# EAGLE design SparkFun_Roshamglo (EAGLE 7.7.0)
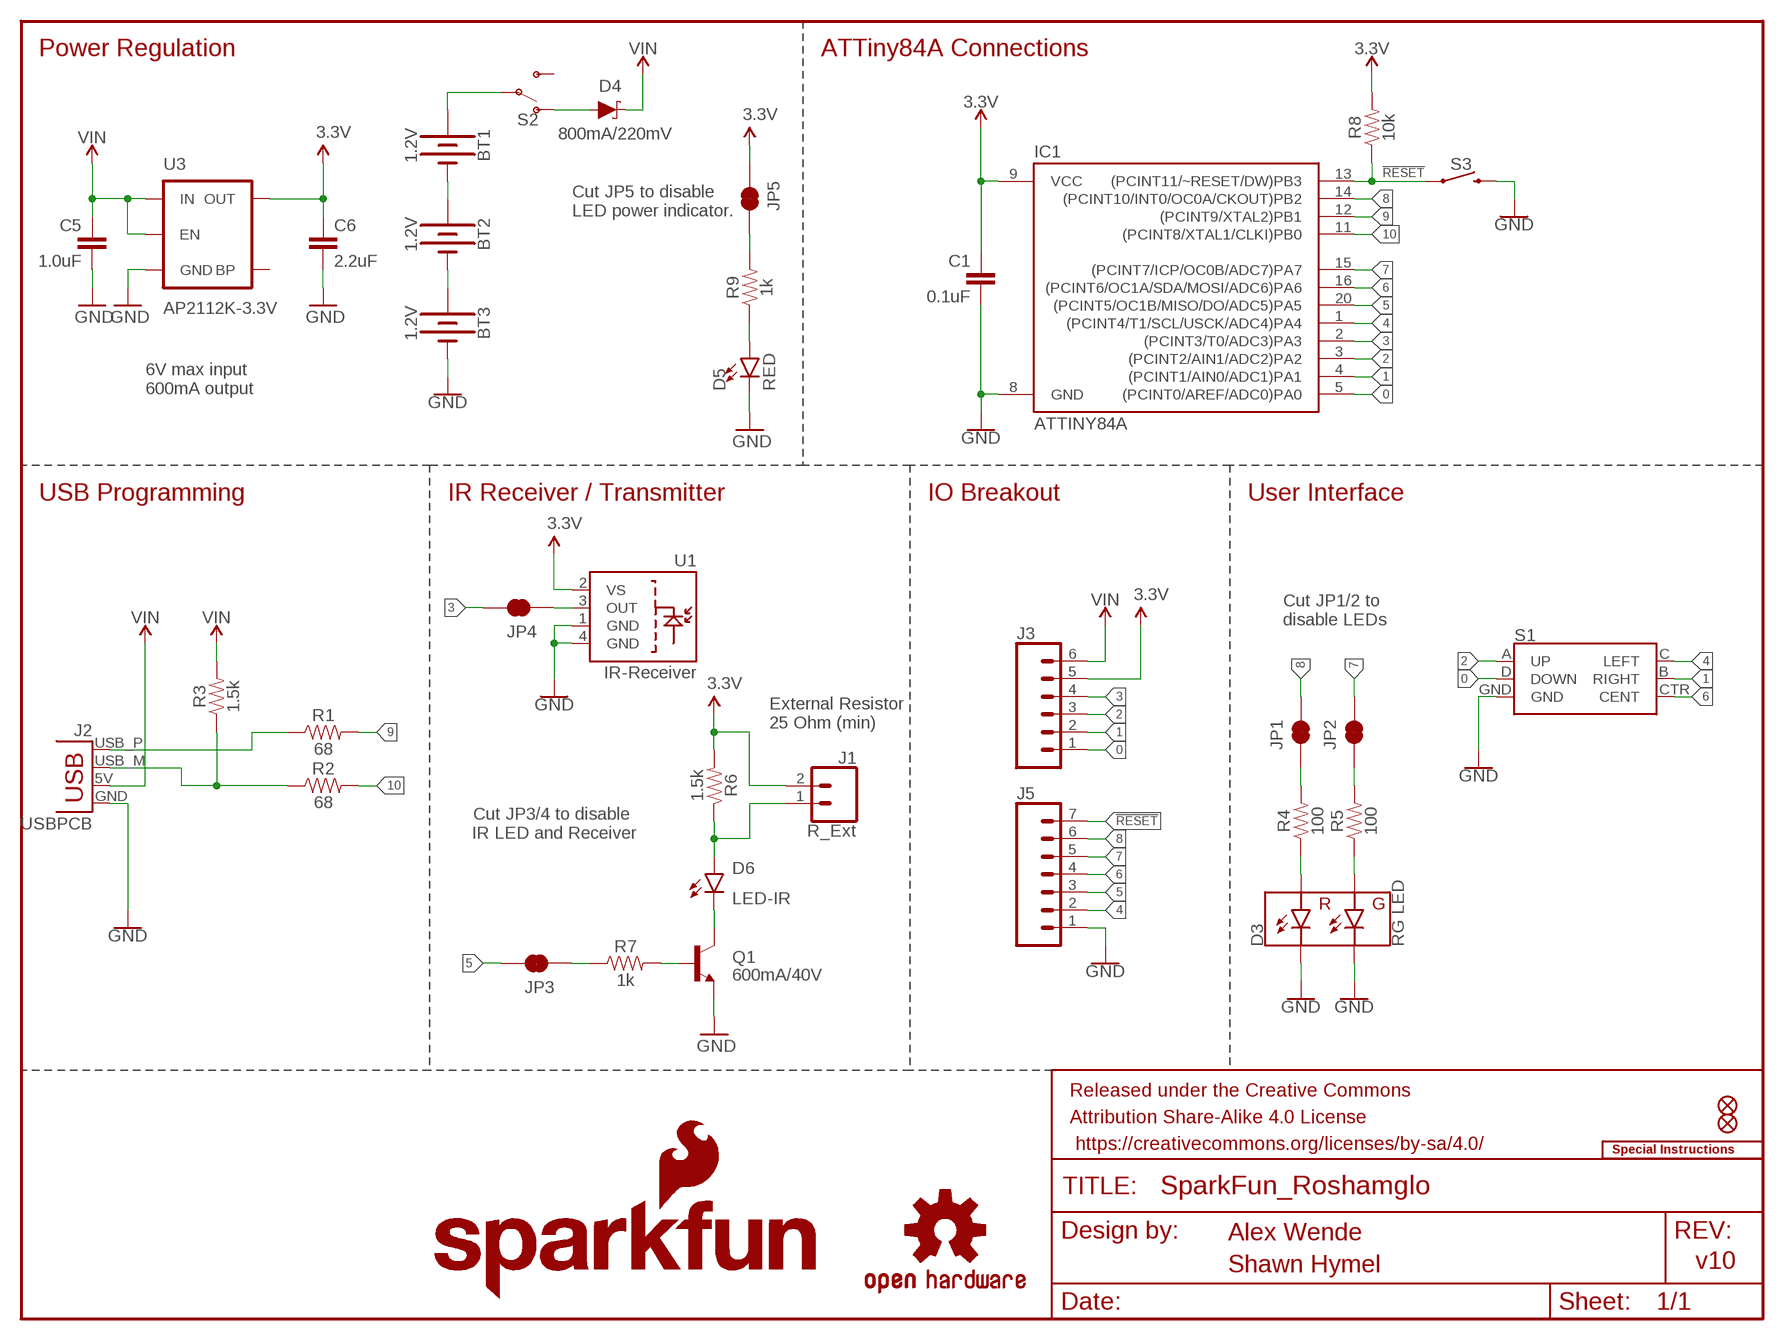
[diagram p0: schematic, sheet 1]

## Parts
BT1  1.2V  BATTERY-AAA_KIT  [BATTERY-AAA-KIT]
BT2  1.2V  BATTERY-AAA_KIT  [BATTERY-AAA-KIT]
BT3  1.2V  BATTERY-AAA_KIT  [BATTERY-AAA-KIT]
C1  0.1uF  0.1UF-0603-25V-(+80/-20%)  [0603]
C5  1.0uF  1.0UF-25V-+80/-20(0805)"  [0805-CAP]
C6  2.2uF  2.2UF-10V-20%(0603)  [0603-CAP]
D3  RG LED  LED-RGLTST-C195KGJRKT  [LTST-C195KGJRKT]
D4  800mA/220mV  CUS08F30SOD-323  [SOD-323]
D5  RED  LED-RED0603  [LED-0603]
D6  LED-IR  LED-IR-SMDSFH4045N  [SFH4045N]
FD1  FIDUCIALUFIDUCIAL  [FIDUCIAL-MICRO]
FD2  FIDUCIALUFIDUCIAL  [FIDUCIAL-MICRO]
FRAME1  FRAME-LETTER  [CREATIVE_COMMONS]
IC1  ATTINY84A  ATTINY84ATTINY84-20MU  [QFN20]
J1  R_Ext  CONN_021X02_NO_SILK  [1X02_NO_SILK]
J2  USBPCB  USBPCB_NOPASTE  [USB-A-PCB-NOPASTE]
J3  CONN_06NO_SILK_FEMALE_PTH  [1X06_NO_SILK]
J5  CONN_07NO_SILK  [1X07_NO_SILK]
JP1  JUMPER-SMT_2_NC_TRACE_SILK  [SMT-JUMPER_2_NC_TRACE_SILK]
JP2  JUMPER-SMT_2_NC_TRACE_SILK  [SMT-JUMPER_2_NC_TRACE_SILK]
JP3  JUMPER-SMT_2_NC_TRACE_SILK  [SMT-JUMPER_2_NC_TRACE_SILK]
JP4  JUMPER-SMT_2_NC_TRACE_SILK  [SMT-JUMPER_2_NC_TRACE_SILK]
JP5  JUMPER-SMT_2_NC_TRACE_SILK  [SMT-JUMPER_2_NC_TRACE_SILK]
LOGO1  OSHW-LOGOS  [OSHW-LOGO-S]
LOGO2  SFE_LOGO_NAME_FLAME.2_INCH  [SFE_LOGO_NAME_FLAME_.2]
Q1  600mA/40V  TRANS_NPN-MMBT2222AL  [SOT23-3]
R1  68  68OHM-0603-1/10W-1%  [0603]
R2  68  68OHM-0603-1/10W-1%  [0603]
R3  1.5k  1.5KOHM-0603-1/10W-1%  [0603]
R4  100  100OHM-0603-1/10W-1%  [0603]
R5  100  100OHM-0603-1/10W-1%  [0603]
R6  1.5k  1.5KOHM-0603-1/10W-1%  [0603]
R7  1k  1KOHM-0603-1/10W-1%  [0603]
R8  10k  10KOHM-0603-1/10W-1%  [0603]
R9  1k  1KOHM-0603-1/10W-1%  [0603]
S1  JOYSTICK_MINI  [JOYSTICK_MINI]
S2  SWITCH-SPDT-SMD-RIGHT-ANGLE  [SWITCH_SPST_SMD_A]
S3  MOMENTARY-SWITCH-SPST-SMD-4.6X2.8MM  [TACTILE_SWITCH_SMD_4.6X2.8MM]
U1  IR-Receiver  TSOP75XXXWSIDE_VIEW  [TSOP75XXXWTR]
U3  AP2112K-3.3V  V_REG_LDOSMD  [SOT23-5]
U$5  SPECIAL_INSTRUCTIONS-ORDERING  [ORDERING_INSTRUCTIONS]

## Nets
0: IC1.5((PCINT0/AREF/ADC0)PA0) J3.1 S1.D(DOWN)
1: IC1.4((PCINT1/AIN0/ADC1)PA1) J3.2 S1.B(RIGHT)
2: IC1.3((PCINT2/AIN1/ADC2)PA2) J3.3 S1.A(UP)
3: IC1.2((PCINT3/T0/ADC3)PA3) J3.4 JP4.2
3.3V: C1.1 C6.1 IC1.9(VCC) J1.2 J3.5 JP5.1 R6.2 R8.2 U1.2(VS) U3.5(OUT)
4: IC1.1((PCINT4/T1/SCL/USCK/ADC4)PA4) J5.2 S1.C(LEFT)
5: IC1.20((PCINT5/OC1B/MISO/DO/ADC5)PA5) J5.3 JP3.2
6: IC1.16((PCINT6/OC1A/SDA/MOSI/ADC6)PA6) J5.4 S1.CTR(CENT)
7: IC1.15((PCINT7/ICP/OC0B/ADC7)PA7) J5.5 JP2.2
8: IC1.14((PCINT10/INT0/OC0A/CKOUT)PB2) J5.6 JP1.2
9: IC1.12((PCINT9/XTAL2)PB1) R1.2
10: IC1.11((PCINT8/XTAL1/CLKI)PB0) R2.2
!RESET: IC1.13((PCINT11/~RESET/DW)PB3) J5.7 R8.1 S3.1 S3.2
D+: J2.USB_P(D+) R1.1
D-: J2.USB_M(D-) R2.1 R3.1
GND: BT3.GND@1(-) C1.2 C5.2 C6.2 D3.P$3(GC) D3.P$4(RC) D5.C IC1.8(GND) J2.GND J5.1 Q1.2(E) S1.GND S3.3 S3.4 U1.1(GND) U1.4(GND) U3.2(GND)
N$1: D5.A R9.1
N$2: D3.P$2(RA) R4.1
N$3: D4.A S2.1(O)
N$4: D3.P$1(GA) R5.1
N$5: D6.1(C) Q1.3(C)
N$6: Q1.1(B) R7.2
N$7: JP1.1 R4.2
N$8: JP2.1 R5.2
N$9: JP4.1 U1.3(OUT)
N$10: JP3.1 R7.1
N$11: JP5.2 R9.2
N$12: BT1.GND@1(-) BT2.PWR@1(+)
N$13: BT2.GND@1(-) BT3.PWR@1(+)
N$14: D6.2(A) J1.1 R6.1
V_BATT: BT1.PWR@1(+) S2.2(P)
VIN: C5.1 D4.C J2.5V(VBUS) J3.6 R3.2 U3.1(IN) U3.3(EN)
Unconnected: S2.3(S) U3.4(BP)

## Notes on the sheet
- Power Regulation | ATTiny84A Connections
- Cut JP5 to disable
  LED power indicator.
- 6V max input
  600mA output
- USB Programming | IR Receiver / Transmitter | IO Breakout | User Interface
- Cut JP1/2 to
  disable LEDs
- External Resistor
  25 Ohm (min)
- Cut JP3/4 to disable 
  IR LED and Receiver
- Alex Wende
- Shawn Hymel | v10

## Library data of the parts
BT1-BT3 = SparkFun-Batteries:BATTERY: Battery - Single Cell A variety of battery chemistries, sizes, and footprints. Device List: 20MM_PTH - Coin Cell Battery Holder - 20mm (PTH) <https://www.sparkfun.com/products/783> 12MM_SMD - Coin Cell Battery Holder - 12mm (SMD) <https://www.sparkfun.com/products/10592> 12MM_PTH - Coin Cell Battery Holder - 12mm (PTH) <https://www.sparkfun.com/products/7948> 20MM_SMD - 20mm Coin Cell Battery Holder (SMD) (2 legs) Used on the Big Time Watch Kit <https://www.sparkfun.com/products/11734> 20MM_SMD_4LEGS - Coin Cell Battery Holder - 20mm (SMD) <https://www.sparkfun.com/products/11892> 20MM_SMD_4LEGS_OVERPASTE - Coin Cell Battery Holder - 20mm (SMD) <https://www.sparkfun.com/products/11892> (Over-paste on the legs) 24.5MM_PTH - Coin Cell Battery Holder - 24.5mm (PTH) <https://www.sparkfun.com/products/8863> 9V - 9V Battery Holder - PC Mount Used on the SparkFun SparkPunk Sound Kit <https://www.sparkfun.com/products/11177> and SparkFun SparkPunk Sequencer Kit <https://www.sparkfun.com/products/12707> 18650 - Battery Holder - 18650 (PTH) <https://www.sparkfun.com/products/13113> AA - Battery Holder - 1xAA (PTH) <https://www.sparkfun.com/products/7949> AAA - Battery Holder - 1xAAA (PTH) <https://www.sparkfun.com/products/12718> AA_KIT - Battery Holder - 1xAA (PTH) <https://www.sparkfun.com/products/7949> Special kit package - pads only have exposed copper on one side of the board. AAA_KIT - Battery Holder - 1xAAA (PTH) <https://www.sparkfun.com/products/12718> Special kit package - pads only have exposed copper on one side of the board.; PROD_ID: BATT-08571; SF_SKU: PRT-12718
C1 = SparkFun-Capacitors:0.1UF: 0.1µF ceramic capacitors A capacitor is a passive two-terminal electrical component used to store electrical energy temporarily in an electric field.; PROD_ID: CAP-00810
C5 = SparkFun-Capacitors:1.0UF-25V-+80/-20(0805): CAP-11625; PROD_ID: CAP-11625
C6 = SparkFun-Capacitors:2.2UF-10V-20%(0603): CAP-07888; PROD_ID: CAP-07888
D3 = SparkFun-LED:LED-RG: LiteOn Technology Corporation LTST-C195KGJRKT - LED GREEN/RED CLEAR 0606 SMD Color: Red/Green Lens Transparency: Clear Lens Style/Size: Rectangle with Flat top, 1.10 x 1.5 mm mC Rating45mcd Red, 35 mcd Green Current: 20mA Red, 20mA Green Forward Voltage: 2V Red, 2V Green Packages: 0606 SparkFun Products: Electric Imp imp002 Breakout <[https://www.sparkfun.com/products/12958]>; PROD_ID: DIO-12140
D4 = Roshamglo:CUS08F30; PROD_ID: DIO-13570
D5 = SparkFun-LED:LED-RED: Red SMD LED Used in manufacturing of most products at SparkFun Packages: 0603 - SMD 0603 package [Product Link] <http://docs.avagotech.com/docs/AV02-0551EN> 0603 SMART - SMD 0603 SMART package ( more efficient and expensive)[Product Link] <http://www.osram-os.com/Graphics/XPic2/00077099_0.pdf> 1206 - SMD1206 package [Product Link] <https://www.sparkfun.com/datasheets/DevTools/LilyPad/Q150OVS4.pdff> SparkFun Products: Pro Mini 328 -5V <https://www.sparkfun.com/products/821> RedBoard <https://www.sparkfun.com/products/12757> IOIO-OTG <https://www.sparkfun.com/products/13613>; PROD_ID: DIO-00819
D6 = Roshamglo:LED-IR-SMD: IR LED - Surface mount Surface mount (SMD) infrared (IR) LEDs SparkFun Products: N/A <https://www.sparkfun.com/>; PROD_ID: DIO-13574
FD1 FD2 = SparkFun-Aesthetics:FIDUCIAL: Fiducial Alignment Points Point-of-reference for pick-and-place machines and other optical instruments.
FRAME1 = SparkFun-Aesthetics:FRAME-LETTER: Schematic Frame - Letter Standard 8.5x11 US Letter frame
IC1 = SparkFun-IC-Microcontroller:ATTINY84: Atmel 14-pin 2/4/8kB flash uC Datasheet <https://cdn.sparkfun.com/datasheets/Widgets/doc8006.pdf> SparkFun Products Tiny AVR Programmer <https://www.sparkfun.com/products/11801> (PGM-11801) SparkFun Servo Trigger - Continuous Rotation <https://www.sparkfun.com/products/13872> (WIG-13872) SparkFun Servo Trigger <https://www.sparkfun.com/products/13118> (WIG-13118); PROD_ID: IC-13571
J1 = SparkFun-Connectors:CONN_02: Multi connection point. Often used as Generic Header-pin footprint for 0.1 inch spaced/style header connections On any of the 0.1 inch spaced packages, you can populate with these: Break Away Headers - Straight <https://www.sparkfun.com/products/116> (PRT-00116) Break Away Male Headers - Right Angle <https://www.sparkfun.com/products/553> (PRT-00553) Female Headers <https://www.sparkfun.com/products/115> (PRT-00115) Break Away Headers - Machine Pin <https://www.sparkfun.com/products/117> (PRT-00117) Break Away Female Headers - Swiss Machine Pin <https://www.sparkfun.com/products/743> (PRT-00743) For SCREWTERMINALS and SPRING TERMINALS visit here: Screw Terimnals on SparkFun.com <https://www.sparkfun.com/search/results?term=Screw+Terminals> (5mm/3.5mm/2.54mm spacing) This device is also useful as a general connection point to wire up your design to another part of your project. Our various solder wires solder well into these plated through hole pads. Hook-Up Wire - Assortment (Stranded, 22 AWG) <https://www.sparkfun.com/products/11375> (PRT-11375) Hook-Up Wire - Assortment (Solid Core, 22 AWG) <https://www.sparkfun.com/products/11367> (PRT-11367) View the entire wire category on our website here <https://www.sparkfun.com/categories/141> Special notes: Molex polarized connector foot print use with: PRT-08233 with associated crimp pins and housings. 2.54_SCREWTERM for use with PRT-10571. 3.5mm Screw Terminal footprints for PRT-08084 5mm Screw Terminal footprints for use with PRT-08432
J2 = SparkFun-Connectors:USB: USB Connectors USB-B-PTH is fully proven SKU : PRT-00139/CONN-08278 USB-miniB is fully proven SKU : PRT-00587 USB-A-PCB is untested. USB-A-H is throughly reviewed, but untested. Spark Fun Electronics SKU : PRT-00437 USB-B-SMT is throughly reviewed, but untested. Needs silkscreen touching up. USB-A-S has not been used/tested USB-MB-H has not been used/tested USB-MICROB has been used. CONN-09505
J3 = SparkFun-Connectors:CONN_06: Multi connection point. Often used as Generic Header-pin footprint for 0.1 inch spaced/style header connections On any of the 0.1 inch spaced packages, you can populate with these: Break Away Headers - Straight <https://www.sparkfun.com/products/116> (PRT-00116) Break Away Male Headers - Right Angle <https://www.sparkfun.com/products/553> (PRT-00553) Female Headers <https://www.sparkfun.com/products/115> (PRT-00115) Break Away Headers - Machine Pin <https://www.sparkfun.com/products/117> (PRT-00117) Break Away Female Headers - Swiss Machine Pin <https://www.sparkfun.com/products/743> (PRT-00743) Arduino Stackable Header - 6 Pin <https://www.sparkfun.com/products/9280> (PRT-09280) For SCREWTERMINALS and SPRING TERMINALS visit here: Screw Terimnals on SparkFun.com <https://www.sparkfun.com/search/results?term=Screw+Terminals> (5mm/3.5mm/2.54mm spacing) This device is also useful as a general connection point to wire up your design to another part of your project. Our various solder wires solder well into these plated through hole pads. Hook-Up Wire - Assortment (Stranded, 22 AWG) <https://www.sparkfun.com/products/11375> (PRT-11375) Hook-Up Wire - Assortment (Solid Core, 22 AWG) <https://www.sparkfun.com/products/11367> (PRT-11367) View the entire wire category on our website here <https://www.sparkfun.com/categories/141> Special notes: Molex polarized connector foot print use with SKU : PRT-08231 with associated crimp pins and housings. 1MM SMD Version SKU: PRT-10208 NOTES ON THE VARIANTS LOCK and LOCK_LONGPADS... This footprint was designed to help hold the alignment of a through-hole component (i.e. 6-pin header) while soldering it into place. You may notice that each hole has been shifted either up or down by 0.005 of an inch from it's more standard position (which is a perfectly straight line). This slight alteration caused the pins (the squares in the middle) to touch the edges of the holes. Because they are alternating, it causes a "brace" to hold the component in place. 0.005 has proven to be the perfect amount of "off-center" position when using our standard breakaway headers. Although looks a little odd when you look at the bare footprint, once you have a header in there, the alteration is very hard to notice. Also,if you push a header all the way into place, it is covered up entirely on the bottom side.; PROD_ID: CONN-08437
J5 = SparkFun-Connectors:CONN_07: Multi connection point. Often used as Generic Header-pin footprint for 0.1 inch spaced/style header connections On any of the 0.1 inch spaced packages, you can populate with these: Break Away Headers - Straight <https://www.sparkfun.com/products/116> (PRT-00116) Break Away Male Headers - Right Angle <https://www.sparkfun.com/products/553> (PRT-00553) Female Headers <https://www.sparkfun.com/products/115> (PRT-00115) Break Away Headers - Machine Pin <https://www.sparkfun.com/products/117> (PRT-00117) Break Away Female Headers - Swiss Machine Pin <https://www.sparkfun.com/products/743> (PRT-00743) For SCREWTERMINALS and SPRING TERMINALS visit here: Screw Terimnals on SparkFun.com <https://www.sparkfun.com/search/results?term=Screw+Terminals> (5mm/3.5mm/2.54mm spacing) This device is also useful as a general connection point to wire up your design to another part of your project. Our various solder wires solder well into these plated through hole pads. Hook-Up Wire - Assortment (Stranded, 22 AWG) <https://www.sparkfun.com/products/11375> (PRT-11375) Hook-Up Wire - Assortment (Solid Core, 22 AWG) <https://www.sparkfun.com/products/11367> (PRT-11367) View the entire wire category on our website here <https://www.sparkfun.com/categories/141> Special notes: Molex polarized connector foot print use with SKU : PRT-08231 with associated crimp pins and housings. 1MM SMD Version SKU: PRT-10208 NOTES ON THE VARIANTS LOCK and LOCK_LONGPADS... This footprint was designed to help hold the alignment of a through-hole component (i.e. 6-pin header) while soldering it into place. You may notice that each hole has been shifted either up or down by 0.005 of an inch from it's more standard position (which is a perfectly straight line). This slight alteration caused the pins (the squares in the middle) to touch the edges of the holes. Because they are alternating, it causes a "brace" to hold the component in place. 0.005 has proven to be the perfect amount of "off-center" position when using our standard breakaway headers. Although looks a little odd when you look at the bare footprint, once you have a header in there, the alteration is very hard to notice. Also,if you push a header all the way into place, it is covered up entirely on the bottom side.
JP1-JP5 = SparkFun-Jumpers:JUMPER-SMT_2_NC_TRACE: Normally closed trace jumper This jumper has a trace between two pads so it's normally closed (NC). Use a razor knife to open the connection. For best results follow the IPC guidelines for cutting traces: Cutout at least 0.063 mm (0.005 in). Remove all loose material to clean up the cut area. Seal the cut with an approved epoxy. Reapply solder to reclose the connection.
LOGO1 = SparkFun-Aesthetics:OSHW-LOGO: Open-Source Hardware (OSHW) Logo This logo indicates the piece of hardware it is found on incorporates a OSHW license and/or adheres to the definition of open source hardware found here: http://freedomdefined.org/OSHW
LOGO2 = SparkFun-Aesthetics:SFE_LOGO_NAME_FLAME: SparkFun Font Logo w/ Flame This is the SparkFun full logo. The logo on the schematic will always be the same size; the package variant is the height of the flame part of the logo. Default layer for the logo on the board is tSilk.
Q1 = SparkFun-DiscreteSemi:TRANS_NPN: NPN transistor Current controlled devices typically used to amplify current or used as a switch. BC547 - COM-08928 <http://www.sparkfun.com/products/8928> (TO-92 45V 100mA) (1.Collector 2.Base 3.Emitter) 2N3904 - COM-00521 <http://www.sparkfun.com/products/521> (TO-92 40V 200mA) (1.Emitter 2.Base 3.Collector) P2N2222A - COM-12852 <http://www.sparkfun.com/products/12852> (TO-92 40V 600mA) (1.Collector 2.Base 3.Emitter); PROD_ID: TRANS-08049
R1 R2 = SparkFun-Resistors:68OHM: 68Ω resistor A resistor is a passive two-terminal electrical component that implements electrical resistance as a circuit element. Resistors act to reduce current flow, and, at the same time, act to lower voltage levels within circuits. - Wikipedia; PROD_ID: RES-07860
R3 R6 = SparkFun-Resistors:1.5KOHM: 1.5kΩ resistor A resistor is a passive two-terminal electrical component that implements electrical resistance as a circuit element. Resistors act to reduce current flow, and, at the same time, act to lower voltage levels within circuits. - Wikipedia; PROD_ID: RES-08306
R4 R5 = SparkFun-Resistors:100OHM: 100Ω resistor A resistor is a passive two-terminal electrical component that implements electrical resistance as a circuit element. Resistors act to reduce current flow, and, at the same time, act to lower voltage levels within circuits. - Wikipedia; PROD_ID: RES-07863
R7 R9 = SparkFun-Resistors:1KOHM: 1kΩ resistor A resistor is a passive two-terminal electrical component that implements electrical resistance as a circuit element. Resistors act to reduce current flow, and, at the same time, act to lower voltage levels within circuits. - Wikipedia; PROD_ID: RES-07856
R8 = SparkFun-Resistors:10KOHM: 10kΩ resistor A resistor is a passive two-terminal electrical component that implements electrical resistance as a circuit element. Resistors act to reduce current flow, and, at the same time, act to lower voltage levels within circuits. - Wikipedia; PROD_ID: RES-00824
S1 = SparkFun-Switches:JOYSTICK_MINI: Small Tactile Joystick w/ Select Switch A 5-way tactile switch allows for a joystick-like interface in a very small package. Part #: 4UCON SF303GJ26 SparkFun Products 5-way Tactile Switch <https://www.sparkfun.com/products/10063> (COM-10063) Used on SparkFun Block for Intel® Edison - OLED <https://www.sparkfun.com/products/13035> (DEV-13035) Used on CAN-BUS Shield <https://www.sparkfun.com/products/13262> (DEV-13262); PROD_ID: SWCH-09905; SF_SKU: COM-10063
S2 = SparkFun-Switches:SWITCH-SPDT: Single Pole, Double Throw (SPDT) Switch Single-pole, double-throw (SPDT) switch. Variant Overview SMD-AYZ0202 Surface Mount DPDT Switch <https://www.sparkfun.com/products/597> (COM-00597) Used on e.g. LilyPad Arduino USB - ATmega32U4 Board <https://www.sparkfun.com/products/12049> PTH-11.6X4.0MM SPDT Mini Power Switch <https://www.sparkfun.com/products/102> (COM-00102) Used on e.g. SparkFun Simon Says - Through-Hole Soldering Kit <https://www.sparkfun.com/products/10547> (KIT-10547) PTH-11.6X4.0MM-KIT KIT version of SPDT Mini Power Switch - Simplifies soldering by removing tStop of switch pins - only one side can be soldered. PTH-11.6X4.0MM-LOCK LOCK version of SPDT Mini Power Switch - Offset pins hold switch in place for easier soldering. SMD-RIGHT-ANGLE Surface Mount Right Angle Switch <https://www.sparkfun.com/products/10860> (COM-10860) Used on e.g. SparkFun ESP8266 Thing <https://www.sparkfun.com/products/13231>; PROD_ID: SWCH-10651; SF_SKU: COM-10860
S3 = SparkFun-Switches:MOMENTARY-SWITCH-SPST: Momentary Switch (Pushbutton) - SPST Normally-open (NO) SPST momentary switches (buttons, pushbuttons). Variants PTH-12MM - 12mm square, through-hole Momentary Pushbutton Switch - 12mm Square <https://www.sparkfun.com/products/9190> (COM-09190) PTH-6.0MM, PTH-6.0MM-KIT - 6.0mm square, through-hole Mini Pushbutton Switch <https://www.sparkfun.com/products/97> (COM-00097) KIT package intended for soldering kit's - only one side of pads' copper is exposed. PTH-RIGHT-ANGLE-KIT - Right-angle, through-hole Right Angle Tactile Button <https://www.sparkfun.com/products/10791> - Used on SparkFun BigTime Watch Kit <https://www.sparkfun.com/products/11734> SMD-12MM - 12mm square, surface-mount Tactile Button - SMD (12mm) <https://www.sparkfun.com/products/12993> (COM-12993) Used on SparkFun PicoBoard <https://www.sparkfun.com/products/11888> SMD-4.5MM - 4.5mm Square Trackball Switch Used on SparkFun Blackberry Trackballer Breakout <https://www.sparkfun.com/products/13169> SMD-4.6MMX2.8MM - 4.60mm x 2.80mm, surface mount Used on SparkFun SAMD21 Mini Breakout <https://www.sparkfun.com/products/13664> SMD-5.2MM, SMD-5.2-REDUNDANT - 5.2mm square, surface-mount Mini Pushbutton Switch - SMD <https://www.sparkfun.com/products/8720> (COM-08720) Used on Arduino Pro Mini <https://www.sparkfun.com/products/11114> REDUNDANT package connects both switch circuits together SMD-6.0X3.5MM - 6.0 x 3.5mm, surface mount Momentary Reset Switch SMD <https://www.sparkfun.com/products/8229> (COM-08229) SMD-6.2MM-TALL - 6.2mm square, surface mount Tactile Button - SMD (6mm) <https://www.sparkfun.com/products/12992> Used on SparkFun Digital Sandbox <https://www.sparkfun.com/products/12651> SMD-RIGHT-ANGLE - Right-angle, surface mount Used on SparkFun Block for Intel® Edison - Arduino <https://www.sparkfun.com/products/13036>; PROD_ID: SWCH-13065
U1 = Roshamglo:TSOP75XXXW: Vishay TSOP75xxxW - IR receiver IR receiver for remote control systems with built-in preamplifier and demodulator. SparkFun Products: N/A <https://www.sparkfun.com>; PROD_ID: SEN-13572
U3 = SparkFun-PowerIC:V_REG_LDO: Voltage Regulator LDO Standard 150mA LDO voltage regulator in SOT-23 layout. Micrel part MIC5205. BP (by-pass) pin is used to lower output noise with 470pF cap.; PROD_ID: VREG-12457
U$5 = SparkFun-Aesthetics:SPECIAL_INSTRUCTIONS: Special Ordering/Production Instructions Alert Symbol for special PCB ordering instructions or unique production process warnings. PCB Standard is 1.6mm FR4, 1 oz copper, immersion silver plating, red soldermask, white silkscreen. Unique production processes may include special wash or depaneling instructions.

## Board
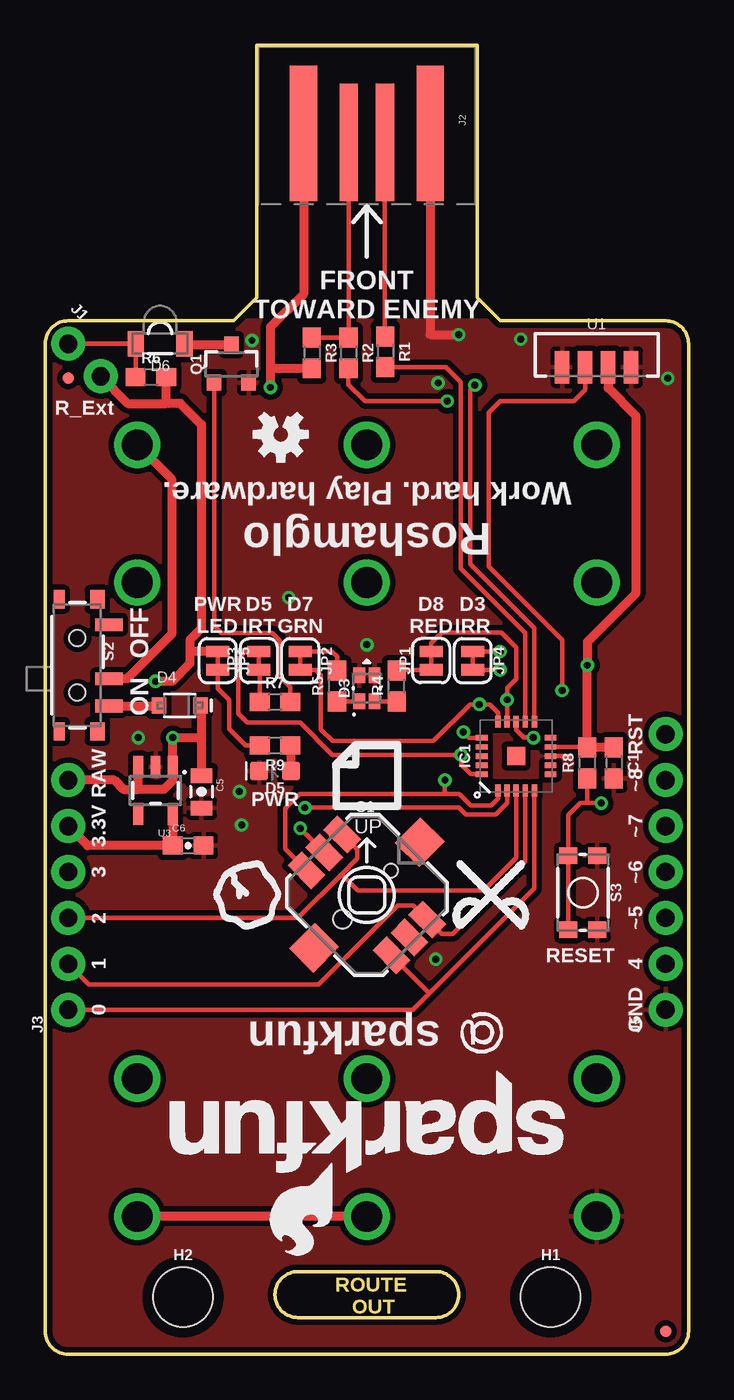
[diagram p1: board, top side]
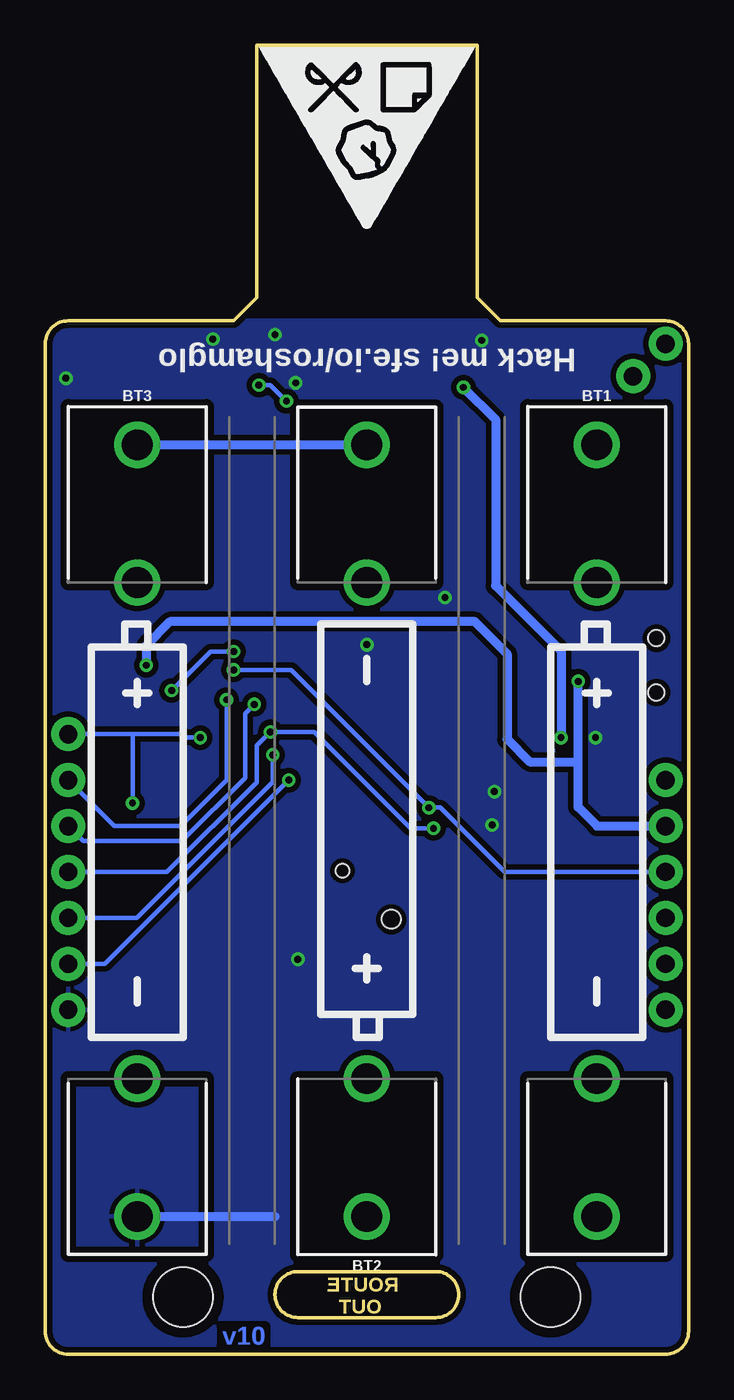
[diagram p2: board, bottom side, seen from below]

Size 35.56 x 72.39 mm. Coordinates in mm from the lower left corner, seen from the top.
Outline: 0,55.88 0,1.27 arc90 1.27,0 34.29,0 arc90 35.56,1.27 35.56,55.88 arc90 34.29,57.15 25.15,57.15 23.88,58.42 23.88,72.39 11.68,72.39 11.68,58.42 10.41,57.15 1.27,57.15 arc90 0,55.88
Outline: 21.59,2.03 13.97,2.03 arc-90 12.7,3.3 arc-90 13.97,4.57 21.59,4.57 arc-90 22.86,3.3 arc-90 21.59,2.03
Copper layers (1*16): Top 0.035mm / dielectric 1.5mm / Bottom 0.035mm
Design rules "SparkFun-2-layer-TIGHT": minimum track width 7mil, minimum drill 15mil, track to track 7mil, track to pad 7mil, pad to pad 7mil, via to via 7mil, smd to smd 7mil, copper to edge 7mil, drill to drill 7mil, minimum pad ring 7mil, minimum via ring 7mil, stop-mask expansion 4mil, vias tented up to drill 25mil, thermal gap 10mil

### Footprints (pad centres in the part's own frame; a part is rotated, then mirrored left to right if it is on the bottom)
BATTERY-AAA-KIT = drill 1.702: GND@1 21.336,0; GND@2 13.716,0; PWR@1 -21.336,0; PWR@2 -13.716,0
0603 = smd 1.1 x 1: 1 -0.85,0; 2 0.85,0
0805-CAP = smd 0.8 x 1.2: 1 -0.9,0; 2 0.9,0
0603-CAP = smd 1.1 x 1: 1 -0.85,0; 2 0.85,0
LTST-C195KGJRKT = smd 0.85 x 0.65: P$1 -0.725,0.425; P$2 -0.725,-0.425; P$3 0.725,0.425; P$4 0.725,-0.425
SOD-323 = smd 0.8 x 0.9: A -1.15,0; C 1.15,0
LED-0603 = smd 1 x 1: A -0.877,0; C 0.877,0
SFH4045N = smd 0.9 x 1.4: 1 -1.35,0; 2 1.35,0
FIDUCIAL-MICRO = smd 0.635 x 0.635: 1 0,0
STAND-OFF = hole 3.302: 0,0
QFN20 = smd 1 x 1: 0 0,0 | smd 0.65 x 0.3: 1 -1.9,1; 2 -1.9,0.5; 3 -1.9,0; 4 -1.9,-0.5; 5 -1.9,-1; 11 1.9,-1; 12 1.9,-0.5; 13 1.9,0; 14 1.9,0.5; 15 1.9,1 | smd 0.3 x 0.65: 6 -1,-1.9; 7 -0.5,-1.9; 8 0,-1.9; 9 0.5,-1.9; 10 1,-1.9; 16 1,1.9; 17 0.5,1.9; 18 0,1.9; 19 -0.5,1.9; 20 -1,1.9
1X02_NO_SILK = drill 1.016 pad 1.88: 1 0,0; 2 2.54,0
USB-A-PCB-NOPASTE = smd 7.5 x 1.5: 5V -0.2,-3.5; GND -0.2,3.5 | smd 6.5 x 1: USB_M 0.3,-1; USB_P 0.3,1
1X06_NO_SILK = drill 1.016 pad 1.88: 1 0,0; 2 2.54,0; 3 5.08,0; 4 7.62,0; 5 10.16,0; 6 12.7,0
1X07_NO_SILK = drill 1.016 pad 1.88: 1 0,0; 2 2.54,0; 3 5.08,0; 4 7.62,0; 5 10.16,0; 6 12.7,0; 7 15.24,0
SMT-JUMPER_2_NC_TRACE_SILK = smd 0.635 x 1.27: 1 -0.508,0; 2 0.508,0
SOT23-3 = smd 0.8 x 0.9: 1 -0.95,-1; 2 0.95,-1; 3 0,1.1
JOYSTICK_MINI = smd 1.85 x 1.1: A -3.325,1.4; B 3.325,1.4; C -3.325,-1.4; CTR -3.325,0; D 3.325,-1.4; GND 3.325,0 | smd 1.9 x 2: NC 0,4.13; NC@0 0,-4.13 | hole 0.75: 0,1.9 | hole 1.05: 0,-1.9
SWITCH_SPST_SMD_A = smd 0.7 x 1.5: 1 -2.25,-1.75; 2 -0.75,-1.75; 3 2.25,-1.75 | smd 1 x 0.6: GND1 -3.65,1; GND3 3.65,1 | smd 1 x 0.8: GND2 -3.65,-1.1; GND4 3.65,-1.1 | hole 0.9: -1.5,0; 1.5,0
TACTILE_SWITCH_SMD_4.6X2.8MM = smd 0.9 x 1: 1 -2.05,-0.8; 2 2.05,-0.8; 3 2.05,0.8; 4 -2.05,0.8
TSOP75XXXWTR = smd 0.8 x 1.8: 1 1.905,-1.3; 2 0.635,-1.3; 3 -0.635,-1.3; 4 -1.905,-1.3
SOT23-5 = smd 0.55 x 1.2: 1 -0.95,-1.3; 2 0,-1.3; 3 0.95,-1.3; 4 0.95,1.3; 5 -0.95,1.3

### Placement (x,y rotation side)
BT1  5.08,28.96 270 bottom
BT2  17.78,28.96 90 bottom
BT3  30.48,28.96 270 bottom
C1  31.43,32.7 270 top
C5  8.64,31.1 270 top
C6  7.9,28.13 0 top
D3  17.78,36.83 90 top
D4  7.43,35.88 0 top
D5  12.7,32.26 180 top
D6  6.35,55.88 180 top
FD1  1.27,53.98 0 top
FD2  34.29,1.27 0 top
FRAME1  -16.51,-17.78 0 top  (outside the outline)
H1  STAND-OFF  [STAND-OFF]  27.94,3.17 0 top
H2  STAND-OFF  [STAND-OFF]  7.62,3.17 0 top
IC1  26.04,33.08 90 top
J1  1.27,55.88 315 top
J2  17.78,67.31 270 top
J3  1.27,19.05 90 top
J5  34.29,19.05 90 top
JP1  21.34,38.35 90 top
JP2  14.1,38.35 270 top
JP3  11.81,38.35 90 top
JP4  23.62,38.35 270 top
JP5  9.53,38.35 270 top
LOGO1  13.02,50.86 180 top
LOGO2  29.4,15.75 180 top
Q1  10.29,54.74 0 top
R1  18.8,55.44 270 top
R2  16.76,55.37 270 top
R3  14.73,55.37 270 top
R4  19.43,36.96 90 top
R5  16.13,36.96 90 top
R6  5.84,54.04 0 top
R7  12.7,36.07 0 top
R8  29.97,32.7 90 top
R9  12.7,33.66 180 top
S1  17.78,25.4 315 top
S2  1.78,38.1 90 top
S3  29.72,25.53 270 top
U1  30.48,55.88 0 top
U3  6.1,31.18 180 top
U$1  [ROSHAMGLO_PAPER]  17.78,32 0 top
U$2  [ROSHAMGLO_ROCK]  11.18,25.4 0 top
U$3  [ROSHAMGLO_SCISSORS]  24.64,25.4 0 top
U$4  [ROSHAMGLO_LOGO_0.4]  17.78,67.31 180 bottom
U$5  -36.83,-21.59 0 top  (outside the outline)

### Tracks (layer width: path | path; a pad name or v marks a point on that pad's centre or on a via)
0
  Top 0.254: S1.D 21.23,19.96 | 21.23,19.96 23.48,22.21 27.04,25.77 IC1.5 | 21.23,19.96 20.32,19.05 J3.1
1
  Top 0.254: IC1.4 26.54,27.25 22.53,23.24 21.92,23.24 S1.B 20.35,24.81 19.48,24.81 15.11,20.45 2.41,20.45 J3.2
2
  Top 0.254: 16.38,26.54 17.25,27.41 17.25,27.91 S1.A | 16.38,26.54 13.97,24.13 J3.3 | IC1.3 26.04,27.46 24.23,25.65 17.27,25.65 16.38,26.54 | J3.3
3  (via drill 0.38)
  Top 0.254: JP4.2 v25.15,37.85 | IC1.2 25.54,30.48 24.89,29.84 23.24,29.84 22.86,30.23 v14.35,30.23
  Bottom 0.254: v25.15,37.85 21.97,37.85 v14.35,30.23 13.72,30.23 10.16,26.67 J3.4
3.3V  (via drill 0.38)
  Top 0.254: IC1.9 29.97,33.58 R8.2
  Top 0.508: C1.1 R8.2 | 7.05,27.94 C6.1 | C6.1 2.35,28.13 J3.5 | U3.5 C6.1 | U1.2 31.11,53.45 32.64,51.92 32.64,42.06 29.97,39.4 v29.97,38.1 29.97,33.58 | J1.2 4.57,52.58 6.69,52.58 | 6.69,52.58 R6.2 | 6.69,52.58 7.47,52.58 8.64,51.41 8.64,40.13 8,39.5 8,38.73 | 8,38.73 8,38.2 7.01,37.21 v6.1,37.21 | JP5.1 8.13,38.86 8,38.73
  Bottom 0.508: v29.97,38.1 29.97,39.2 28.66,40.51 11.81,40.51 10.03,38.73 10.03,34.02 8.78,32.77 6.1,32.77 | 6.1,32.77 6.1,30.25 5.05,29.21 J3.5 | 6.1,32.77 v6.1,37.21
4  (via drill 0.38)
  Top 0.254: 22.1,30.99 14.07,30.99 13.26,30.19 13.26,27.94 S1.C | 22.1,30.99 22.88,30.99 23.52,30.35 24.66,30.35 25.04,30.72 IC1.1 | v22.1,31.75 22.1,30.99
  Bottom 0.254: J5.2 32.26,21.59 v22.1,31.75
5  (via drill 0.38)
  Top 0.254: IC1.20 23.52,32.08 22.99,32.62 v22.99,33.15 15.88,33.15 14.1,34.92 11.18,34.92 10.67,35.43 10.67,38.46 11.07,38.86 JP3.2
  Bottom 0.254: v22.99,33.15 22.99,31.64 30.5,24.13 J5.3
6  (via drill 0.38)
  Top 0.254: v23.11,34.42 23.45,34.08 IC1.16 | S1.CTR v14.1,29.08 | v14.1,29.08
  Bottom 0.254: v14.1,29.08 15.37,29.08 20.7,34.42 v23.11,34.42 23.88,33.66 23.88,31.62 28.83,26.67 J5.4
7  (via drill 0.38)
  Top 0.254: IC1.15 25.04,35.47 24.56,35.94 v24,35.94 23.49,35.94 21.45,33.91 15.89,33.91 15.24,34.56 15.24,37.56 14.96,37.85 JP2.2
  Bottom 0.254: v24,35.94 24.51,35.43 24.51,31.88 28,28.38 33.47,28.38 J5.5
8  (via drill 0.38)
  Top 0.254: IC1.14 v25.54,36.2 25.54,36.84 26.04,37.34 26.04,39.07 25.21,39.9 21.91,39.9 21.34,39.32 JP1.2
  Bottom 0.254: v25.54,36.2 25.53,36.19 25.53,31.75 28.07,29.21 31.75,29.21 J5.6
9
  Top 0.254: R1.2 22.14,54.59 22.98,53.75 22.98,43.44 26.54,39.89 IC1.12
10  (via drill 0.38)
  Top 0.254: R2.2 16.76,53.62 17.68,52.7 v22.23,52.7 | v23.75,53.59 23.5,53.34 23.5,43.69 27.04,40.15 IC1.11
  Bottom 0.254: v22.23,52.7 23.11,53.59 v23.75,53.59
!RESET  (via drill 0.38)
  Top 0.254: IC1.13 26.04,34.52 26.46,34.1 v26.99,34.1 | v30.73,30.48 29.97,30.48 | 29.97,30.48 R8.1 | 29.97,30.48 29.58,30.48 28.92,29.81 S3.1 S3.2
  Bottom 0.254: v30.73,30.48 30.73,34.29 | 30.73,34.29 J5.7 | v26.99,34.1 27.81,34.1 28,34.29 30.73,34.29
D+
  Top 0.254: R1.1 18.78,56.3 J2.USB_P
D-
  Top 0.254: J2.USB_M 16.78,56.24 R2.1 R3.1
GND  (via drill 0.38)
  Top 0.254: IC1.8 28.96,33.08 28.96,33.02
  Top 0.508: J2.GND 21.28,56.39 v22.86,56.39
  Bottom 0.508: BT3.GND@1 22.86,7.62
  other vias: 21.72,53.72 26.29,56.13 34.42,53.98 13.46,41.85 21.59,21.84 11.43,56.07 17.78,39.24 10.86,29.27 10.73,31.11 5.14,34.1
  pour Top (isolate 0.305): 1.27,57.15 34.29,57.15 arc-90 35.56,55.88 35.56,1.27 arc-90 34.29,0 1.27,0 arc-90 0,1.27 0,55.88 arc-90
  pour Bottom (isolate 0.305): 1.27,0 34.29,0 arc90 35.56,1.27 35.56,55.88 arc90 34.29,57.15 1.27,57.15 arc90 0,55.88 0,1.27 arc90
N$1
  Top 0.508: R9.1 13.58,33.66 D5.A
N$2
  Top 0.254: R4.1 D3.P$2
N$3
  Top 0.508: S2.1 6.28,35.85 D4.A
N$4
  Top 0.254: D3.P$1 R5.1
N$5
  Top 0.508: D6.1 7.7,55.84 Q1.3
N$6
  Top 0.254: Q1.1 9.34,40.28 9.74,39.88 12.55,39.88 12.95,39.48 12.95,37.49 13.55,36.89 R7.2
N$7
  Top 0.254: JP1.1 19.43,37.85 R4.2
N$8
  Top 0.254: 16.13,37.85 R5.2 16.13,38.58 15.85,38.86 JP2.1
N$9  (via drill 0.38)
  Top 0.254: U1.3 29.84,53.34 29.21,52.7 25.15,52.7 24.51,52.07 24.51,43.56 28.57,39.5 v28.57,36.7 | v25.15,38.86 JP4.1
  Bottom 0.254: v25.15,38.86 26.42,38.86 v28.57,36.7
N$10
  Top 0.254: JP3.1 11.85,37.85 R7.1
N$11
  Top 0.254: R9.2 11.08,33.66 10.16,34.57 10.16,36.2 9.53,36.83 JP5.2
N$12
  Top 0.508: BT2.PWR@1 BT1.GND@1
N$13
  Bottom 0.508: BT3.PWR@1 BT2.GND@1
N$14
  Top 0.254: R6.1 D6.2 J1.1
V_BATT
  Top 0.508: S2.2 4.52,37.35 6.99,39.82 6.99,48.39 BT1.PWR@1
VIN  (via drill 0.38)
  Top 0.508: 12.45,54.52 R3.2 | 5.14,31.24 4.32,31.24 3.81,31.75 J3.6 | 5.14,31.24 U3.3 | 5.14,31.24 6.55,31.24 7.05,31.74 U3.1 v7.05,34.1 8.64,34.1 | 8.64,34.1 C5.1 | D4.C 8.64,35.88 8.64,34.1 | J2.5V 14.28,58.63 12.45,56.8 12.45,54.52 | 12.45,54.52 v12.45,53.47
  Bottom 0.508: v7.05,34.1 7.05,38.88 10.67,42.5 10.67,51.69 v12.45,53.47

### Text on the board
Bottom: v10
Dimension: ROUTE / OUT
tPlace: FRONT / TOWARD ENEMY | R_Ext | Work hard. Play hardware. | Roshamglo | PWR / LED | D5 / IRT | D7 / GRN | D8 / RED | D3 / IRR | OFF | ON | RST | RAW | ~8 | PWR | 3.3V | ~7 | 3 | ~6 | 2 | ~5 | 1 | RESET | 4 | 0 | GND | sparkfun
bPlace: Hack me! sfe.io/roshamglo
Measures: Units are in Inches
tDocu: Alex Wende / Shawn Hymel | PCB Thickness: 0.078 inch